# EAGLE design esposi-base-v1 (EAGLE 6.6.0)
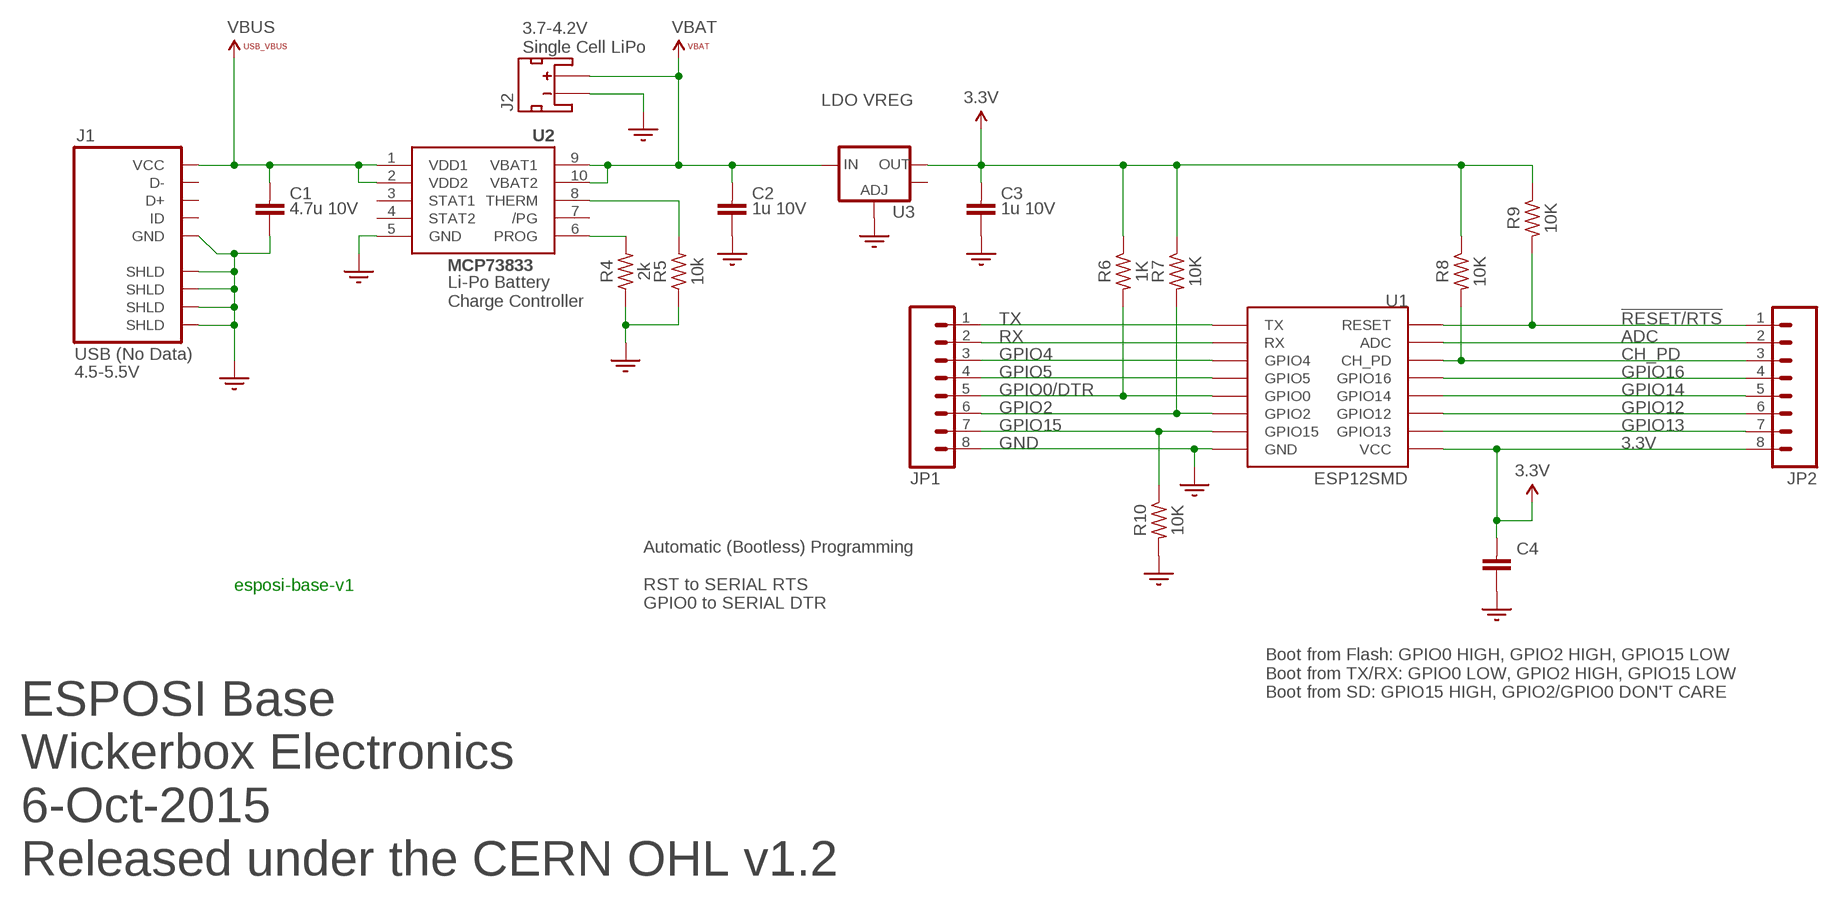
[diagram p0: schematic, sheet 1]

## Parts
C1  4.7u 10V  CAP-0805  [RLC-0805]
C2  1u 10V  CAP-0603  [RLC-0603]
C3  1u 10V  CAP-0603  [RLC-0603]
C4  CAP-0402  [RLC-0402]
J1  USB (No Data)  ZX62D-B-5P8  [ZX62D-B-5P8]
J2  JST_2MM_MALE  [JST-2-SMD]
JP1  M08NO_SILK_FEMALE_PTH  [1X08_NO_SILK]
JP2  M08NO_SILK_FEMALE_PTH  [1X08_NO_SILK]
R4  2k  RES-0402  [RLC-0402]
R5  10k  RES-0402  [RLC-0402]
R6  1K  RES-0402  [RLC-0402]
R7  10K  RES-0402  [RLC-0402]
R8  10K  RES-0402  [RLC-0402]
R9  10K  RES-0402  [RLC-0402]
R10  10K  RES-0402  [RLC-0402]
U1  ESP12SMD  [ESP12_SMD]
U2  MCP73833-UN  [MSOP10]
U3  V_REG_LM1117SOT223  [SOT223]

## Nets
3.3V: C3.2 C4.1 JP2.8 R6.1 R7.1 R8.1 R9.1 U1.VCC U3.2(OUT)
!RESET/RTS: JP2.1 R9.2 U1.RESET
ADC: JP2.2 U1.ADC
CH_PD: JP2.3 R8.2 U1.CH_PD
GND: C1.2 C2.1 C3.1 C4.2 J1.P5(GND) J1.P$1(SHLD) J1.P$2(SHLD) J1.P$3(SHLD) J1.P$4(SHLD) J2.1(-) JP1.8 R4.1 R5.1 R10.2 U1.GND U2.5(GND) U3.1(ADJ)
GPIO0/DTR: JP1.5 R6.2 U1.GPIO0
GPIO2: JP1.6 R7.2 U1.GPIO2
GPIO4: JP1.3 U1.GPIO4
GPIO5: JP1.4 U1.GPIO5
GPIO12: JP2.6 U1.GPIO12
GPIO13: JP2.7 U1.GPIO13
GPIO14: JP2.5 U1.GPIO14
GPIO15: JP1.7 R10.1 U1.GPIO15
GPIO16: JP2.4 U1.GPIO16
PROG: R4.2 U2.6(PROG)
RX: JP1.2 U1.RX
THERM: R5.2 U2.8(THERM)
TX: JP1.1 U1.TX
VBAT: C2.2 J2.2(+) U2.9(VBAT1) U2.10(VBAT2) U3.3(IN)
VBUS: C1.1 J1.P1(VCC) U2.1(VDD1) U2.2(VDD2)
Unconnected: J1.P2(D-) J1.P3(D+) J1.P4(ID) J2.NC1(PAD1) J2.NC2(PAD2) U2.3(STAT1) U2.4(STAT2) U2.7(/PG) U3.4(OUT)

## Notes on the sheet
- 3.7-4.2V
  Single Cell LiPo
- LDO VREG
- Li-Po Battery
  Charge Controller
- 4.5-5.5V
- Automatic (Bootless) Programming
  
  RST to SERIAL RTS
  GPIO0 to SERIAL DTR
- Boot from Flash: GPIO0 HIGH, GPIO2 HIGH, GPIO15 LOW
  Boot from TX/RX: GPIO0 LOW, GPIO2 HIGH, GPIO15 LOW
  Boot from SD: GPIO15 HIGH, GPIO2/GPIO0 DON'T CARE
- ESPOSI Base
  Wickerbox Electronics
  6-Oct-2015
  Released under the CERN OHL v1.2

## Library data of the parts
C1 = max-viz:CAP-0805
C2 C3 = max-viz:CAP-0603
C4 = max-viz:CAP-0402
J1 = con-hirose-microusb:ZX62D-B-5P8
J2 = SparkFun-Connectors:JST_2MM_MALE: Mates to single-cell LiPo batteries. CONN-08352; PROD_ID: CONN-08352
JP1 JP2 = SparkFun-Connectors:M08: Header 8 Standard 8-pin 0.1" header. Use with straight break away headers (SKU : PRT-00116), right angle break away headers (PRT-00553), swiss pins (PRT-00743), machine pins (PRT-00117), and female headers (PRT-00115).; PROD_ID: CONN-08438
R4-R10 = max-viz:RES-0402
U1 = esp8266modules:ESP12: ESP8266 Wifi module 12
U2 = adafruit:MCP73833
U3 = SparkFun-PowerIC:V_REG_LM1117: Voltage Regulator LM1117 Standard adjustable voltage regulator but in SMD form. Spark Fun Electronics SKU : COM-00595; PROD_ID: VREG-08170

## Net classes
0 default: clearance 0.178 mm

## Board
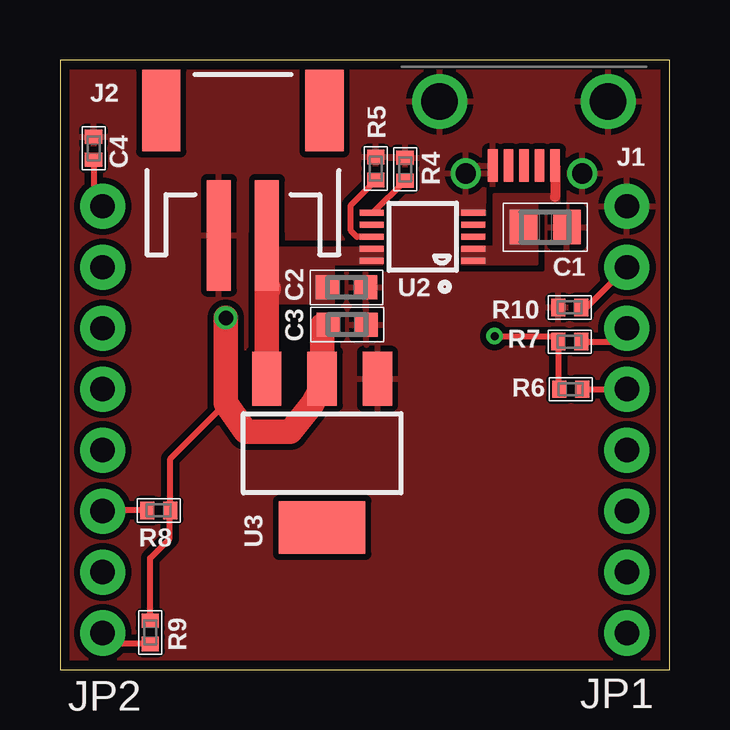
[diagram p1: board, top side]
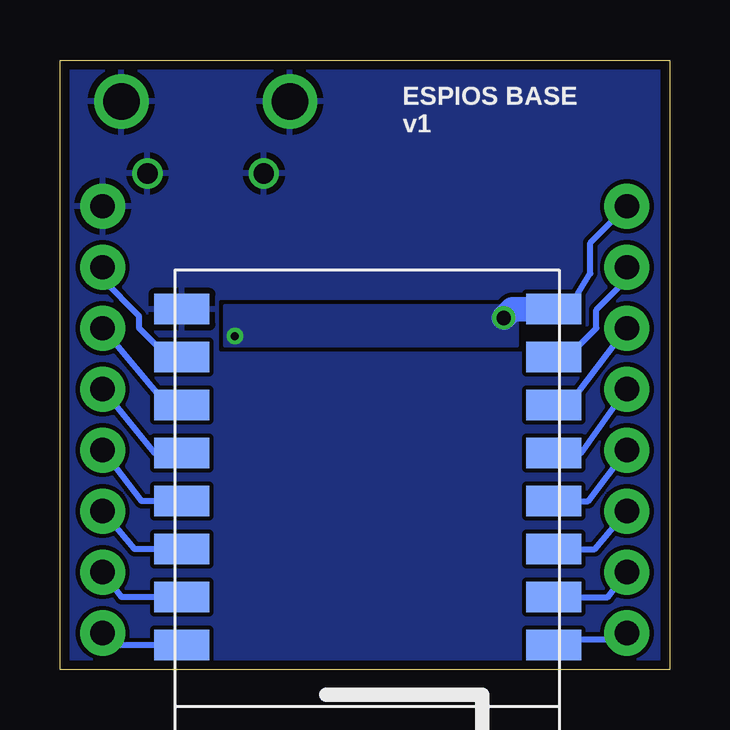
[diagram p2: board, bottom side, seen from below]

Size 25.4 x 25.4 mm. Coordinates in mm from the lower left corner, seen from the top.
Outline: 0,0 25.4,0 25.4,25.4 0,25.4 0,0
Copper layers (1*16): Top 0.0356mm / dielectric 1.5011mm / Bottom 0.0356mm
Design rules "oshpark-2layer": minimum track width 6mil, minimum drill 13mil, track to track 6mil, track to pad 6mil, pad to pad 6mil, via to via 6mil, smd to smd 6mil, copper to edge 15mil, drill to drill 6mil, minimum pad ring 7mil, minimum via ring 7mil, stop-mask expansion 4mil, vias tented up to drill 0mil, thermal gap 10mil

### Footprints (pad centres in the part's own frame; a part is rotated, then mirrored left to right if it is on the bottom)
RLC-0805 = smd 1.15 x 1.45: 1 -0.9,0; 2 0.9,0
RLC-0603 = smd 0.95 x 1: 1 0.8,0; 2 -0.8,0
RLC-0402 = smd 0.59 x 0.72: 1 -0.48,0; 2 0.48,0
ZX62D-B-5P8 = smd 0.4 x 1.35: P1 -1.3,2.675; P2 -0.65,2.675; P3 0,2.675; P4 0.65,2.675; P5 1.3,2.675 | drill 1.524: P$1 3.51,0; P$2 -3.51,0 | drill 0.838: P$3 -2.425,3; P$4 2.425,3
JST-2-SMD = smd 1 x 4.6: 1 -1,-3.7; 2 1,-3.7 | smd 1.6 x 3.4: NC1 -3.4,1.5; NC2 3.4,1.5
1X08_NO_SILK = drill 1.016 pad 1.88: 1 0,0; 2 2.54,0; 3 5.08,0; 4 7.62,0; 5 10.16,0; 6 12.7,0; 7 15.24,0; 8 17.78,0
ESP12_SMD = smd 2.286 x 1.27: ADC -7.874,3.842; CH_PD -7.874,1.842; GND 7.62,-8.158; GPIO0 7.62,-2.158; GPIO2 7.62,-4.158; GPIO4 7.62,1.842; GPIO5 7.62,-0.158; GPIO12 -7.874,-4.158; GPIO13 -7.874,-6.158; GPIO14 -7.874,-2.158; GPIO15 7.62,-6.158; GPIO16 -7.874,-0.158; RESET -7.874,5.842; RX 7.62,3.842; TX 7.62,5.842; VCC -7.874,-8.158
MSOP10 = smd 0.25 x 1: 1 -1,-2.113; 2 -0.5,-2.113; 3 0,-2.113; 4 0.5,-2.113; 5 1,-2.113; 6 1,2.113; 7 0.5,2.113; 8 0,2.113; 9 -0.5,2.113; 10 -1,2.113
SOT223 = smd 1.219 x 2.235: 1 -2.311,-3.099; 2 0,-3.099; 3 2.311,-3.099 | smd 3.6 x 2.2: 4 0,3.099

### Placement (x,y rotation side)
C1  20.22,18.44 0 top
C2  11.94,15.93 0 top
C3  11.96,14.38 0 top
C4  1.4,21.72 90 top
J1  19.33,23.67 180 top
J2  7.62,21.79 0 top
JP1  23.62,1.52 90 top
JP2  1.78,1.52 90 top
R4  14.38,20.85 270 top
R5  13.16,20.88 270 top
R6  21.29,11.68 0 top
R7  21.23,13.67 0 top
R8  4.11,6.63 180 top
R9  3.76,1.55 270 top
R10  21.23,15.09 180 top
U1  12.7,6.86 180 bottom
U2  15.11,18.03 90 top
U3  10.92,9.02 180 top

### Tracks (layer width: path | path; a pad name or v marks a point on that pad's centre or on a via)
3.3V  (via drill 0.33 pad 0.51, 0.6)
  Top 0.254: v18.11,13.89 20.53,13.89 R7.1 20.75,11.73 R6.1 | C3.2 10.95,14.38 10.92,14.35 | 6.91,11.1 4.59,8.79 R8.1 4.57,6.61 4.57,5.46 3.76,4.65 R9.1 | C4.1 1.4,19.68 JP2.8
  Top 1.016: v6.91,14.66 6.91,11.1 7.75,9.91 9.6,9.91 10.52,11.05 10.92,11.84 U3.2 10.92,14.35
  Bottom 0.254: U1.VCC 4.14,15.14 3.3,16.51 3.3,17.78 JP2.8
  Bottom 1.016: U1.VCC 6.55,15.02 v6.91,14.66
  pour Bottom: 6.38,15.19 18.54,15.16 18.54,13.49 6.35,13.49 6.35,15.14
!RESET/RTS
  Top 0.254: R9.2 2.23,1.07 JP2.1
  Bottom 0.254: U1.RESET 4.57,1.02 4.57,1.27 2.03,1.27 JP2.1
ADC
  Bottom 0.254: U1.ADC 2.57,3.02 JP2.2
CH_PD
  Top 0.254: R8.2 1.8,6.63 JP2.3
  Bottom 0.254: U1.CH_PD 3.11,5.02 JP2.3
GND
  pour Bottom (rank 3): 0,-0.25 25.65,-0.25 25.65,25.4 0,25.4
  pour Top (isolate 0.254, rank 5): 0,-0.25 25.65,-0.25 25.4,25.4 0,25.4
  pour Top (no thermals): 17.68,18.97 17.68,19.48 16.48,19.48 16.48,18.97
GPIO0/DTR
  Top 0.254: R6.2 JP1.5
  Bottom 0.254: U1.GPIO0 21.46,9.02 JP1.5
GPIO2
  Top 0.254: R7.2 23.06,13.66 JP1.6
  Bottom 0.254: U1.GPIO2 20.92,11.02 JP1.6
GPIO4
  Bottom 0.254: U1.GPIO4 22.29,5.02 JP1.3
GPIO5
  Bottom 0.254: U1.GPIO5 22,7.02 JP1.4
GPIO12
  Bottom 0.254: U1.GPIO12 4.22,11.02 JP2.6
GPIO13
  Bottom 0.254: U1.GPIO13 4.26,13.02 3.05,14.22 3.05,14.99 1.78,16.26 JP2.7
GPIO14
  Bottom 0.254: U1.GPIO14 3.68,9.02 JP2.5
GPIO15
  Top 0.254: R10.1 21.95,15.09 JP1.7
  Bottom 0.254: JP1.7 23.62,16.26 22.1,14.73 22.1,14.22 20.89,13.02 U1.GPIO15
GPIO16
  Bottom 0.254: U1.GPIO16 3.4,7.02 JP2.4
PROG
  Top 0.254: U2.6 13.04,19.03 R4.2
RX
  Bottom 0.254: U1.RX 22.83,3.02 JP1.2
THERM
  Top 0.254: U2.8 12.37,18.03 12.12,18.29 12.12,19.36 R5.2
TX
  Bottom 0.254: U1.TX 23.37,1.02 JP1.1
VBAT
  Top 1.016: J2.2 8.62,15.95 | 8.62,15.95 8.62,13.8 U3.3 | 8.7,15.88 8.62,15.95
  pour Top (no thermals): 13.44,17.58 8.18,17.55 8.18,15.29 11.38,15.29 11.38,16.92 13.44,16.92
VBUS
  Top 0.406: J1.P1 20.63,19.69 20.62,19.68
  pour Top (no thermals): 16.76,16.92 16.76,17.6 18.08,17.6 18.08,19.79 20.78,19.79 20.78,19.48 19.86,19.51 19.86,16.92

### Text on the board
bPlace: ESPIOS BASE / v1